# Altium project Jameskathrein_HubProModel_v1.0.PrjPcb
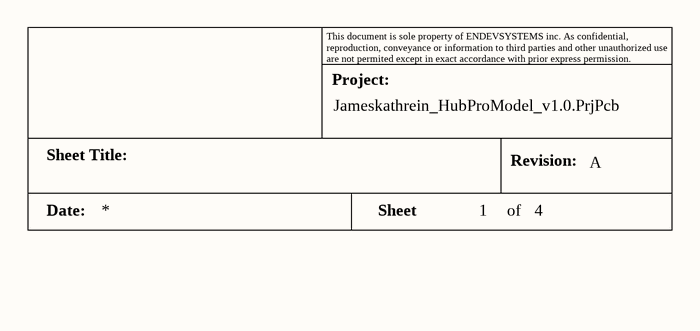
[diagram p0: Sheet1.SchDoc]
Revision: A
2 sheets, 2 parts. Net scope: global (net labels, ports and power ports of the same name join across sheets).
Board file: HubProModel_v1.0.PcbDoc
Sheets:
  Sheet1.SchDoc
  Sheet2.SchDoc

## Sheet Sheet1.SchDoc
size A3; SheetNumber: 1; SheetTotal: 4

### Parts
(Parts that share a designator on the sheet are numbered #1, #2 ... from top to bottom, then left to right.)
?#1  Title_Block  (value not drawn)  (graphical)

### Notes on the sheet
- (in symbol Title_Block) This document is sole property of ENDEVSYSTEMS inc. As confidential, reproduction, conveyance or information to third parties and other unauthorized use are not permited except in exact accordance with prior express permission.; Project:; Sheet Title:; Revision:; Date:; Sheet; of

## Sheet Sheet2.SchDoc
size A3; SheetNumber: 1; SheetTotal: 4
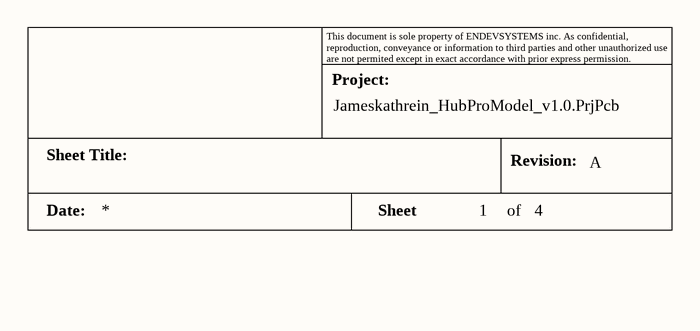
[diagram p1: Sheet2.SchDoc]

### Parts
(Parts that share a designator on the sheet are numbered #1, #2 ... from top to bottom, then left to right.)
?#2  Title_Block  (value not drawn)  (graphical)

### Notes on the sheet
- (in symbol Title_Block) This document is sole property of ENDEVSYSTEMS inc. As confidential, reproduction, conveyance or information to third parties and other unauthorized use are not permited except in exact accordance with prior express permission.; Project:; Sheet Title:; Revision:; Date:; Sheet; of